# EAGLE design T4p1_cutout (EAGLE 9.6.2)
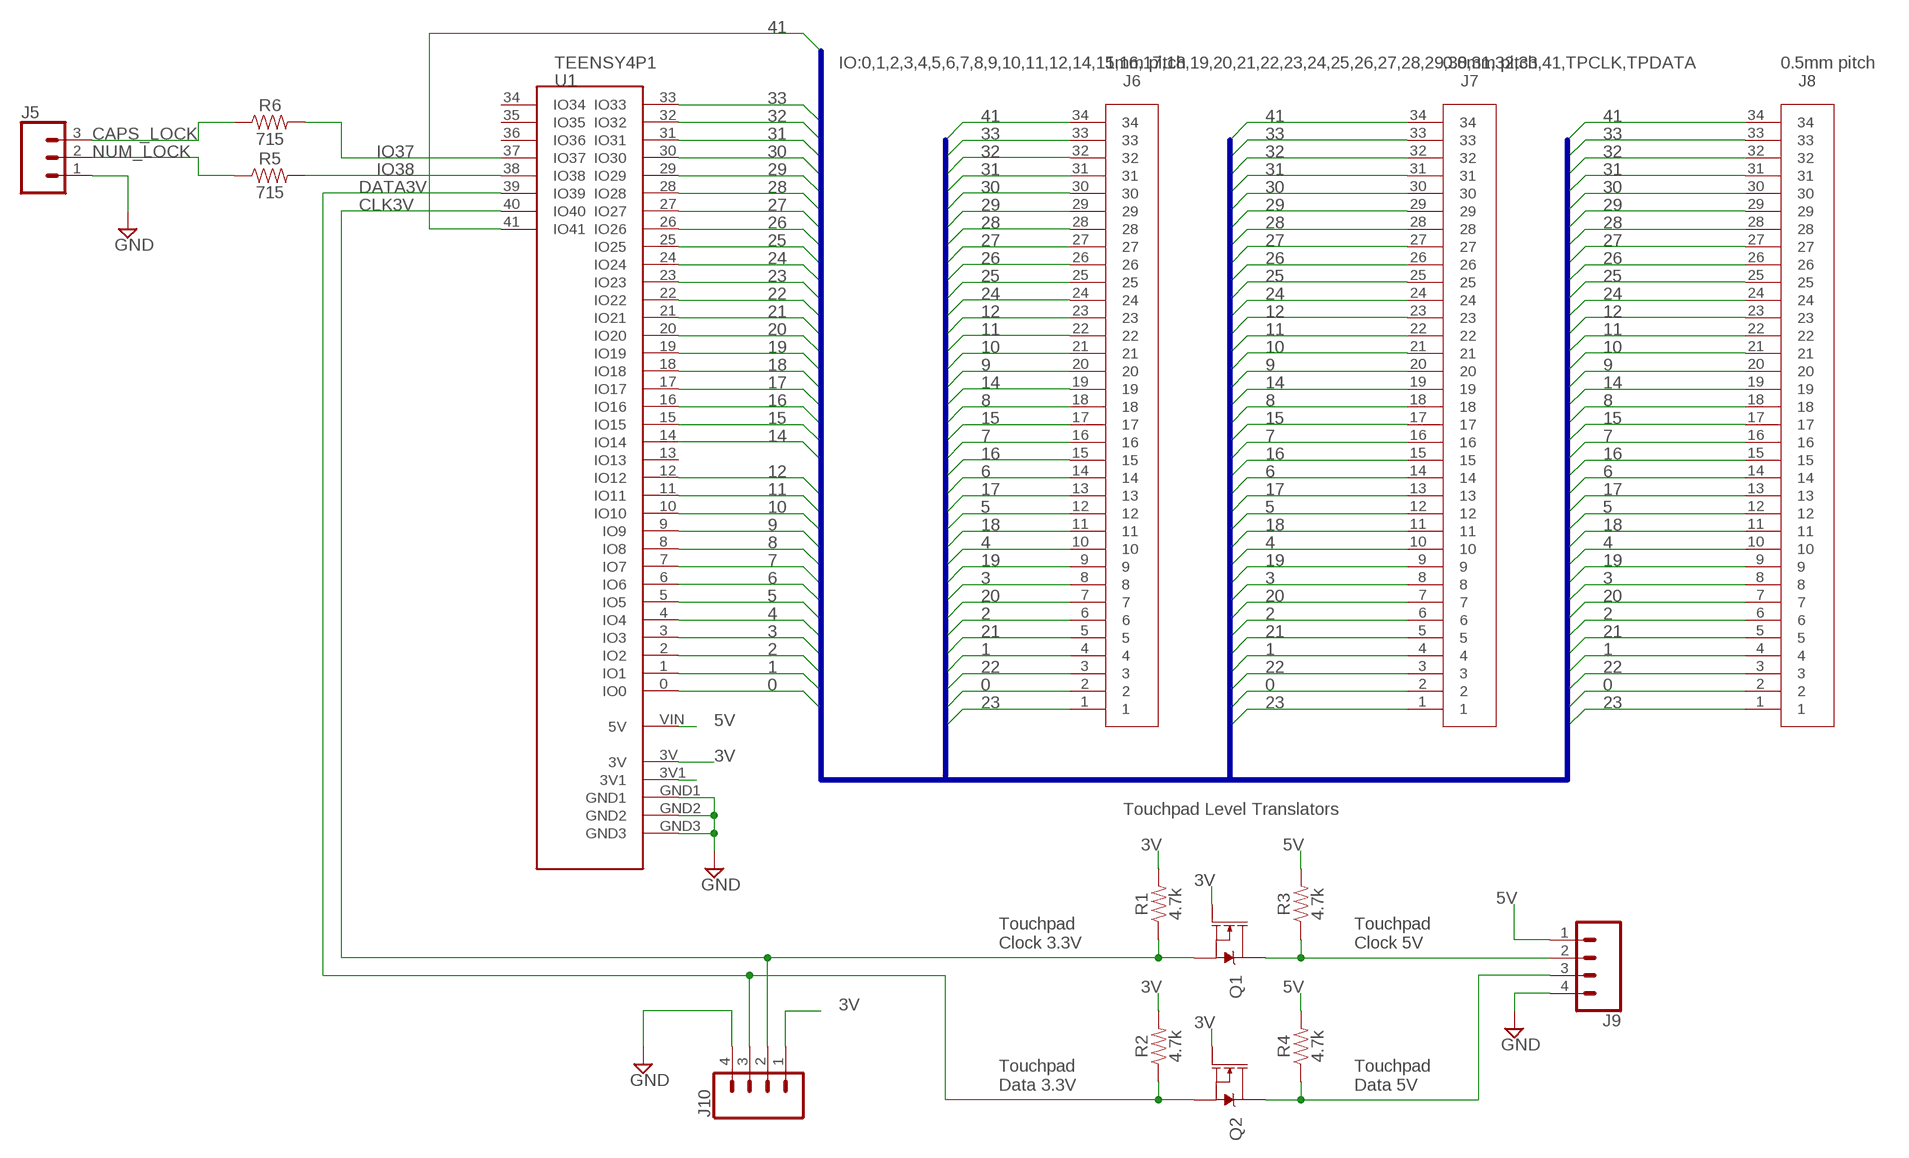
[diagram p0: schematic, sheet 1]

## Parts
J5  CONN_031X03_NO_SILK  [1X03_NO_SILK]
J6  FPC34  [FPC34]
J7  FPC34_P8MM  [FPC34_P8MM]
J8  FPC34_P5MM  [FPC34_P5MM]
J9  CONN_041X04_NO_SILK  [1X04_NO_SILK]
J10  CONN_041X04_NO_SILK  [1X04_NO_SILK]
Q1  220mA/50V/3.5Ω  MOSFET-NCH-BSS138  [SOT23-3]
Q2  220mA/50V/3.5Ω  MOSFET-NCH-BSS138  [SOT23-3]
R1  4.7k  4.7KOHM-0603-1/10W-1%  [0603]
R2  4.7k  4.7KOHM-0603-1/10W-1%  [0603]
R3  4.7k  4.7KOHM-0603-1/10W-1%  [0603]
R4  4.7k  4.7KOHM-0603-1/10W-1%  [0603]
R5  715  715OHM-0603-1/10W-1%  [0603]
R6  715  715OHM-0603-1/10W-1%  [0603]
U1  TEENSY4P1  TEENSY4P1_CUTOUT  [TEENSY4P0_CUTOUT]

## Nets
0: J6.2 J7.2 J8.2 U1.0(IO0)
1: J6.4 J7.4 J8.4 U1.1(IO1)
2: J6.6 J7.6 J8.6 U1.2(IO2)
3: J6.8 J7.8 J8.8 U1.3(IO3)
3V: J10.1 Q1.1(G) Q2.1(G) R1.2 R2.2 U1.3V
4: J6.10 J7.10 J8.10 U1.4(IO4)
5: J6.12 J7.12 J8.12 U1.5(IO5)
5V: J9.1 R3.2 R4.2 U1.VIN(5V)
6: J6.14 J7.14 J8.14 U1.6(IO6)
7: J6.16 J7.16 J8.16 U1.7(IO7)
8: J6.18 J7.18 J8.18 U1.8(IO8)
9: J6.20 J7.20 J8.20 U1.9(IO9)
10: J6.21 J7.21 J8.21 U1.10(IO10)
11: J6.22 J7.22 J8.22 U1.11(IO11)
12: J6.23 J7.23 J8.23 U1.12(IO12)
14: J6.19 J7.19 J8.19 U1.14(IO14)
15: J6.17 J7.17 J8.17 U1.15(IO15)
16: J6.15 J7.15 J8.15 U1.16(IO16)
17: J6.13 J7.13 J8.13 U1.17(IO17)
18: J6.11 J7.11 J8.11 U1.18(IO18)
19: J6.9 J7.9 J8.9 U1.19(IO19)
20: J6.7 J7.7 J8.7 U1.20(IO20)
21: J6.5 J7.5 J8.5 U1.21(IO21)
22: J6.3 J7.3 J8.3 U1.22(IO22)
23: J6.1 J7.1 J8.1 U1.23(IO23)
24: J6.24 J7.24 J8.24 U1.24(IO24)
25: J6.25 J7.25 J8.25 U1.25(IO25)
26: J6.26 J7.26 J8.26 U1.26(IO26)
27: J6.27 J7.27 J8.27 U1.27(IO27)
28: J6.28 J7.28 J8.28 U1.28(IO28)
29: J6.29 J7.29 J8.29 U1.29(IO29)
30: J6.30 J7.30 J8.30 U1.30(IO30)
31: J6.31 J7.31 J8.31 U1.31(IO31)
32: J6.32 J7.32 J8.32 U1.32(IO32)
33: J6.33 J7.33 J8.33 U1.33(IO33)
41: J6.34 J7.34 J8.34 U1.41(IO41)
CAPS_LOCK: J5.3 R6.1
CLK3V: J10.2 Q1.2(S) R1.1 U1.40(IO40)
CLK5V: J9.2 Q1.3(D) R3.1
DATA3V: J10.3 Q2.2(S) R2.1 U1.39(IO39)
DATA5V: J9.3 Q2.3(D) R4.1
GND: J5.1 J9.4 J10.4 U1.GND1 U1.GND2 U1.GND3
IO37: R6.2 U1.37(IO37)
IO38: R5.2 U1.38(IO38)
N$1: U1.3V1
NUM_LOCK: J5.2 R5.1
Unconnected: U1.13(IO13) U1.34(IO34) U1.35(IO35) U1.36(IO36)

## Buses
IO:0,1,2,3,4,5,6,7,8,9,10,11,12,14,15,16,17,18,19,20,21,22,23,24,25,26,27,28,29,30,31,32,33,41,TPCLK,TPDATA

## Notes on the sheet
- 1mm pitch | 0.8mm pitch | 0.5mm pitch
- Touchpad Level Translators
- Touchpad
  Clock 3.3V
- Touchpad
  Clock 5V
- Touchpad
  Data 3.3V
- Touchpad
  Data 5V

## Library data of the parts
J5 = SparkFun-Connectors:CONN_03: Multi connection point. Often used as Generic Header-pin footprint for 0.1 inch spaced/style header connections On any of the 0.1 inch spaced packages, you can populate with these: Break Away Headers - Straight <https://www.sparkfun.com/products/116> (PRT-00116) Break Away Male Headers - Right Angle <https://www.sparkfun.com/products/553> (PRT-00553) Female Headers <https://www.sparkfun.com/products/115> (PRT-00115) Break Away Headers - Machine Pin <https://www.sparkfun.com/products/117> (PRT-00117) Break Away Female Headers - Swiss Machine Pin <https://www.sparkfun.com/products/743> (PRT-00743) Stackable Header - 3 Pin (Female, 0.1") <https://www.sparkfun.com/products/13875> (PRT-13875) For SCREWTERMINALS and SPRING TERMINALS visit here: Screw Terimnals on SparkFun.com <https://www.sparkfun.com/search/results?term=Screw+Terminals> (5mm/3.5mm/2.54mm spacing) This device is also useful as a general connection point to wire up your design to another part of your project. Our various solder wires solder well into these plated through hole pads. Hook-Up Wire - Assortment (Stranded, 22 AWG) <https://www.sparkfun.com/products/11375> (PRT-11375) Hook-Up Wire - Assortment (Solid Core, 22 AWG) <https://www.sparkfun.com/products/11367> (PRT-11367) View the entire wire category on our website here <https://www.sparkfun.com/categories/141> Special notes: Molex polarized connector foot print use with SKU : PRT-08232 with associated crimp pins and housings.
J6 = FPC34:FPC34: Molex Right Angle FPC Connector 1mm pitch, bottom contacts with 32 pins. Molex Part Number DigiKey Part Number
J7 = FPC34_p8mm:FPC34_P8MM: Molex Right Angle FPC Connector 1mm pitch, bottom contacts with 32 pins. Molex Part Number DigiKey Part Number
J8 = FPC34_p5mm:FPC34_P5MM: Molex Right Angle FPC Connector 1mm pitch, bottom contacts with 32 pins. Molex Part Number DigiKey Part Number
J9 J10 = SparkFun-Connectors:CONN_04: Multi connection point. Often used as Generic Header-pin footprint for 0.1 inch spaced/style header connections On any of the 0.1 inch spaced packages, you can populate with these: Break Away Headers - Straight <https://www.sparkfun.com/products/116> (PRT-00116) Break Away Male Headers - Right Angle <https://www.sparkfun.com/products/553> (PRT-00553) Female Headers <https://www.sparkfun.com/products/115> (PRT-00115) Break Away Headers - Machine Pin <https://www.sparkfun.com/products/117> (PRT-00117) Break Away Female Headers - Swiss Machine Pin <https://www.sparkfun.com/products/743> (PRT-00743) For SCREWTERMINALS and SPRING TERMINALS visit here: Screw Terimnals on SparkFun.com <https://www.sparkfun.com/search/results?term=Screw+Terminals> (5mm/3.5mm/2.54mm spacing) This device is also useful as a general connection point to wire up your design to another part of your project. Our various solder wires solder well into these plated through hole pads. Hook-Up Wire - Assortment (Stranded, 22 AWG) <https://www.sparkfun.com/products/11375> (PRT-11375) Hook-Up Wire - Assortment (Solid Core, 22 AWG) <https://www.sparkfun.com/products/11367> (PRT-11367) View the entire wire category on our website here <https://www.sparkfun.com/categories/141> Special notes: Molex polarized connector foot print use with SKU : PRT-08231 with associated crimp pins and housings. 1MM SMD Version SKU: PRT-10208; PROD_ID: CONN-09696
Q1 Q2 = SparkFun-DiscreteSemi:MOSFET-NCH: N-channel MOSFETs Voltage controlled devices that allow control of high current outputs. SparkFun Products: SparkFun OpenScale <https://www.sparkfun.com/products/13261> SparkFun Digital Sandbox <https://www.sparkfun.com/products/12651> SparkFun Monster Moto Shield <https://www.sparkfun.com/products/10182> SparkFun MOSFET Power Controller <https://www.sparkfun.com/products/11214>; PROD_ID: TRANS-00830
R1-R4 = SparkFun-Resistors:4.7KOHM: 4.7kΩ resistor A resistor is a passive two-terminal electrical component that implements electrical resistance as a circuit element. Resistors act to reduce current flow, and, at the same time, act to lower voltage levels within circuits. - Wikipedia; PROD_ID: RES-07857
R5 R6 = SparkFun-Resistors:715OHM: 715Ω resistor A resistor is a passive two-terminal electrical component that implements electrical resistance as a circuit element. Resistors act to reduce current flow, and, at the same time, act to lower voltage levels within circuits. - Wikipedia; PROD_ID: RES-07850
U1 = TEENSY4P1_CUTOUT:TEENSY4P1_CUTOUT

## Board
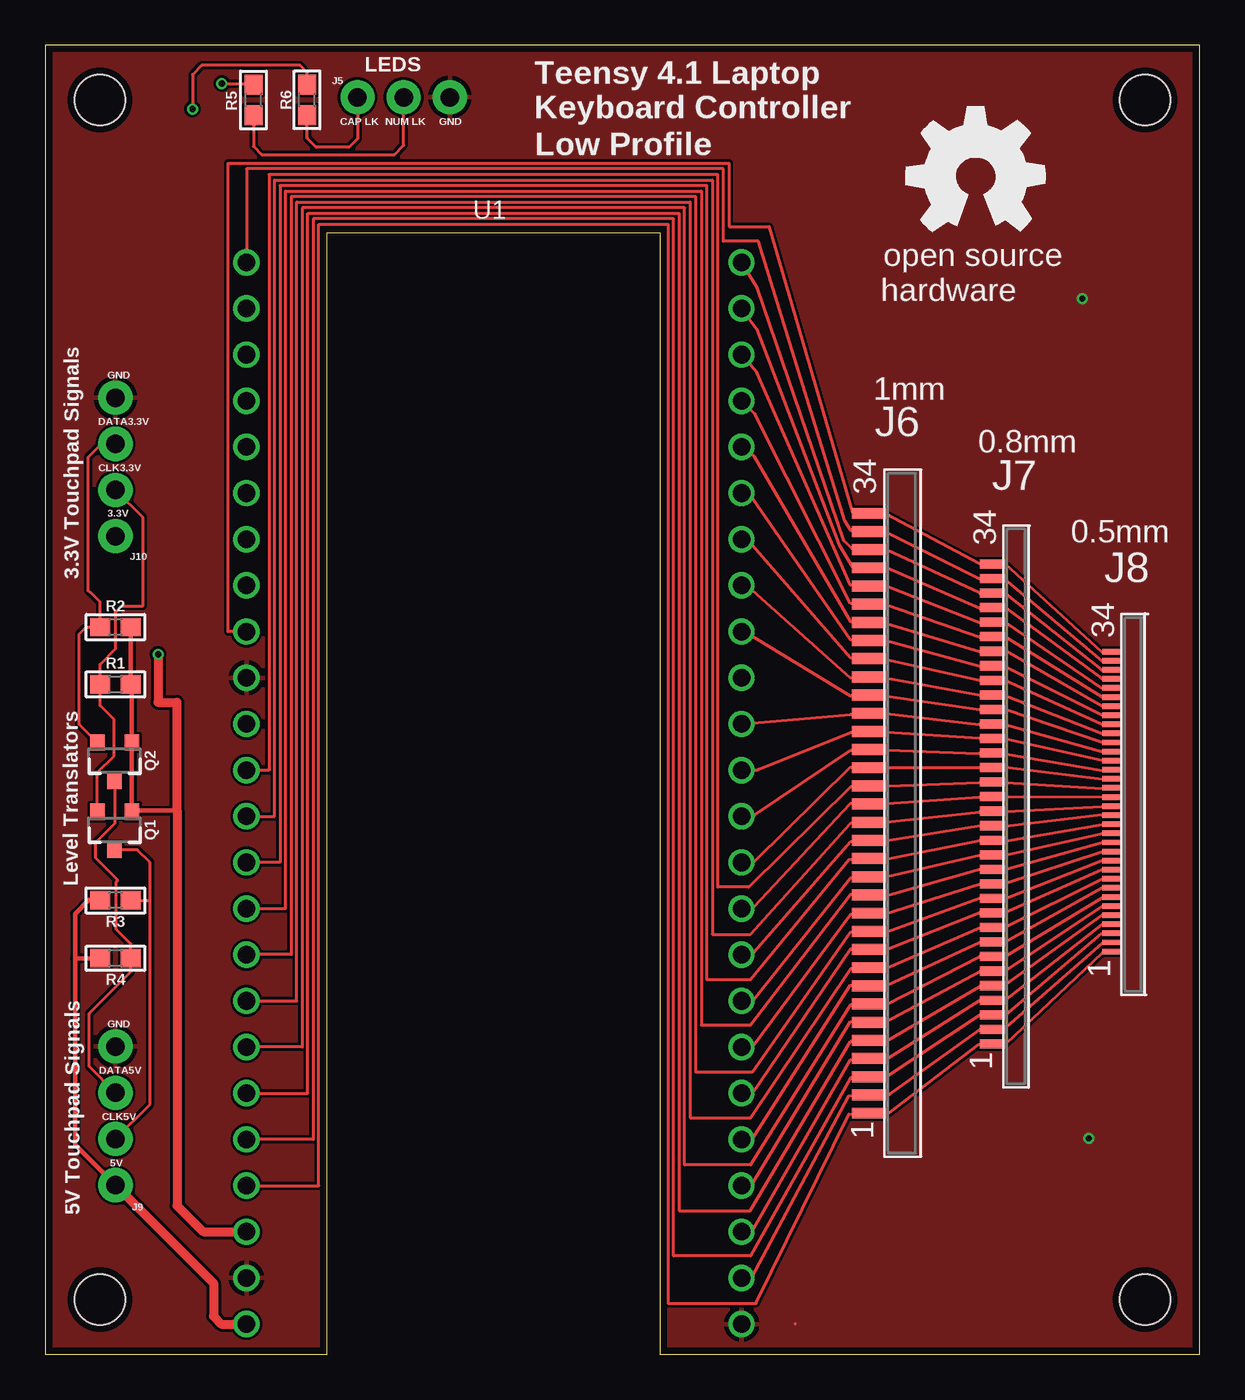
[diagram p1: board, top side]
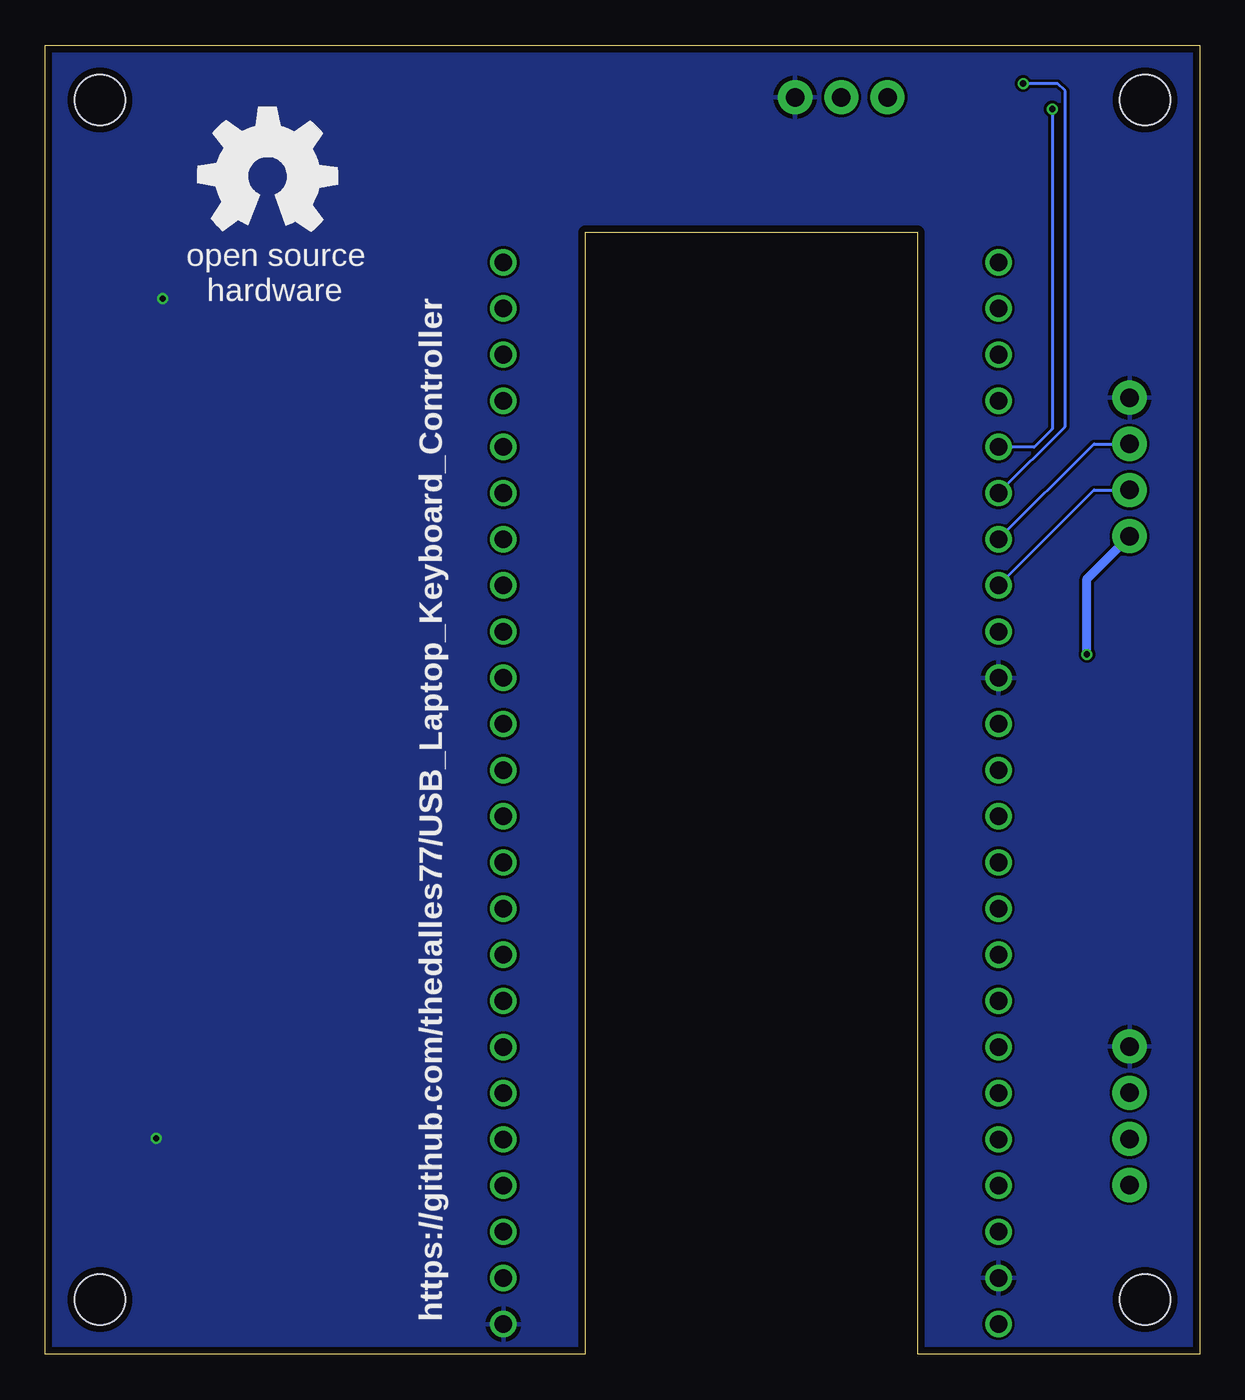
[diagram p2: board, bottom side, seen from below]

Size 63.5 x 72 mm. Coordinates in mm from the lower left corner, seen from the top.
Outline: 0,0 15.5,0 15.5,61.7 33.8,61.7 33.8,0 63.5,0 63.5,72 0,72 0,0
Copper layers (1*16): Top 0.035559375mm / dielectric 1.6mm / Bottom 0.035559375mm
Design rules "oshpark-2layer": minimum track width 6mil, minimum drill 10mil, track to track 6mil, track to pad 6mil, pad to pad 6mil, via to via 6mil, smd to smd 6mil, copper to edge 15mil, drill to drill 6mil, minimum pad ring 5mil, minimum via ring 5mil, stop-mask expansion 2.5mil, vias tented up to drill 0mil, thermal gap 10mil
Holes 2.8 mm at 3,3 60.5,3 60.5,69 3,69

### Footprints (pad centres in the part's own frame; a part is rotated, then mirrored left to right if it is on the bottom)
1X03_NO_SILK = drill 1.016 pad 1.88: 1 0,0; 2 2.54,0; 3 5.08,0
FPC34 = smd 0.6 x 1.9: 1 -13.7,3.86; 2 -12.7,3.86; 3 -11.7,3.86; 4 -10.7,3.86; 5 -9.7,3.86; 6 -8.7,3.86; 7 -7.7,3.86; 8 -6.7,3.86; 9 -5.7,3.86; 10 -4.7,3.86; 11 -3.7,3.86; 12 -2.7,3.86; 13 -1.7,3.86; 14 -0.7,3.86; 15 0.3,3.86; 16 1.3,3.86; 17 2.3,3.86; 18 3.3,3.86; 19 4.3,3.86; 20 5.3,3.86; 21 6.3,3.86; 22 7.3,3.86; 23 8.3,3.86; 24 9.3,3.86; 25 10.3,3.86; 26 11.3,3.86; 27 12.3,3.86; 28 13.3,3.86; 29 14.3,3.86; 30 15.3,3.86; 31 16.3,3.86; 32 17.3,3.86; 33 18.3,3.86; 34 19.3,3.86
FPC34_P8MM = smd 0.5 x 1.35: 1 -13.7,3.6; 2 -12.9,3.6; 3 -12.1,3.6; 4 -11.3,3.6; 5 -10.5,3.6; 6 -9.7,3.6; 7 -8.9,3.6; 8 -8.1,3.6; 9 -7.3,3.6; 10 -6.5,3.6; 11 -5.7,3.6; 12 -4.9,3.6; 13 -4.1,3.6; 14 -3.3,3.6; 15 -2.5,3.6; 16 -1.7,3.6; 17 -0.9,3.6; 18 -0.1,3.6; 19 0.7,3.6; 20 1.5,3.6; 21 2.3,3.6; 22 3.1,3.6; 23 3.9,3.6; 24 4.7,3.6; 25 5.5,3.6; 26 6.3,3.6; 27 7.1,3.6; 28 7.9,3.6; 29 8.7,3.6; 30 9.5,3.6; 31 10.3,3.6; 32 11.1,3.6; 33 11.9,3.6; 34 12.7,3.6
FPC34_P5MM = smd 0.3 x 1.1: 1 -13.7,3.5; 2 -13.2,3.5; 3 -12.7,3.5; 4 -12.2,3.5; 5 -11.7,3.5; 6 -11.2,3.5; 7 -10.7,3.5; 8 -10.2,3.5; 9 -9.7,3.5; 10 -9.2,3.5; 11 -8.7,3.5; 12 -8.2,3.5; 13 -7.7,3.5; 14 -7.2,3.5; 15 -6.7,3.5; 16 -6.2,3.5; 17 -5.7,3.5; 18 -5.2,3.5; 19 -4.7,3.5; 20 -4.2,3.5; 21 -3.7,3.5; 22 -3.2,3.5; 23 -2.7,3.5; 24 -2.2,3.5; 25 -1.7,3.5; 26 -1.2,3.5; 27 -0.7,3.5; 28 -0.2,3.5; 29 0.3,3.5; 30 0.8,3.5; 31 1.3,3.5; 32 1.8,3.5; 33 2.3,3.5; 34 2.8,3.5
1X04_NO_SILK = drill 1.016 pad 1.88: 1 0,0; 2 2.54,0; 3 5.08,0; 4 7.62,0
SOT23-3 = smd 0.8 x 0.9: 1 -0.95,-1; 2 0.95,-1; 3 0,1.1
0603 = smd 1.1 x 1: 1 -0.85,0; 2 0.85,0
TEENSY4P0_CUTOUT = drill 0.965: 0 -15.24,-13.62; 1 -12.7,-13.62; 2 -10.16,-13.62; 3 -7.62,-13.62; 3V -12.7,13.62; 3V1 17.78,-13.62; 4 -5.08,-13.62; 5 -2.54,-13.62; 6 0,-13.62; 7 2.54,-13.62; 8 5.08,-13.62; 9 7.62,-13.62; 10 10.16,-13.62; 11 12.7,-13.62; 12 15.24,-13.62; 13 15.24,13.62; 14 12.7,13.62; 15 10.16,13.62; 16 7.62,13.62; 17 5.08,13.62; 18 2.54,13.62; 19 0,13.62; 20 -2.54,13.62; 21 -5.08,13.62; 22 -7.62,13.62; 23 -10.16,13.62; 24 20.32,-13.62; 25 22.86,-13.62; 26 25.4,-13.62; 27 27.94,-13.62; 28 30.48,-13.62; 29 33.02,-13.62; 30 35.56,-13.62; 31 38.1,-13.62; 32 40.64,-13.62; 33 40.64,13.62; 34 38.1,13.62; 35 35.56,13.62; 36 33.02,13.62; 37 30.48,13.62; 38 27.94,13.62; 39 25.4,13.62; 40 22.86,13.62; 41 20.32,13.62; GND1 -17.78,-13.62; GND2 -15.24,13.62; GND3 17.78,13.62; VIN -17.78,13.62

### Placement (x,y rotation side)
J5  22.25,69.15 180 top
J6  49.17,26.96 90 top
J7  55.7,30.77 90 top
J8  62.2,35.85 90 top
J9  3.85,9.3 90 top
J10  3.85,45 90 top
Q1  3.8,28.84 180 top
Q2  3.8,32.65 180 top
R1  3.85,36.85 0 top
R2  3.85,40 0 top
R3  3.85,24.97 180 top
R4  3.85,21.78 180 top
R5  11.45,69 90 top
R6  14.4,69 90 top
U1  24.68,19.43 90 top
U$1  [OSHW_8MM]  51.16,64.79 0 top
U$2  [OSHW_8MM]  51.25,64.79 0 top

### Tracks (layer width: path | path; a pad name or v marks a point on that pad's centre or on a via)
0
  Top 0.152: J8.2 58.16,22.62 52.86,18.01 J7.2 51.45,17.86 46.41,14.25 J6.2 44.2,14.2 38.84,4.18 38.83,4.19 U1.0
1
  Top 0.152: J8.4 58.12,23.63 52.81,19.48 J7.4 51.41,19.46 46.32,16.23 J6.4 44.3,16.2 38.87,6.72 38.86,6.73 U1.1
2
  Top 0.152: J8.6 58.13,24.63 52.79,21.08 J7.6 51.4,21.03 46.21,18.25 J6.6 44.3,18.3 38.8,9.2 38.73,9.27 U1.2
3
  Top 0.152: J8.8 58.15,25.65 52.79,22.64 J7.8 51.43,22.65 46.28,20.26 J6.8 44.3,20.3 38.84,11.77 38.81,11.81 U1.3
3V  (via drill 0.35)
  Top 0.254: R2.2 R1.2 4.75,36.8 Q2.1 Q1.1 4.75,29.9 7.24,29.9
  Top 0.508: v6.2,38.5 6.2,35.85 7.24,35.85 7.24,29.9 7.24,8.17 8.68,6.73 U1.3V
  Bottom 0.508: v6.2,38.5 6.2,42.65 J10.1
4
  Top 0.152: J8.10 58.13,26.63 52.79,24.26 J7.10 51.41,24.26 46.26,22.25 J6.10 44.3,22.3 38.88,14.31 38.84,14.35 U1.4
5
  Top 0.152: J8.12 58.15,27.62 52.79,25.88 J7.12 51.4,25.84 46.28,24.22 J6.12 44.3,24.2 38.86,16.88 38.86,16.89 U1.5
5V
  Top 0.254: R3.2 2.4,24.97 2.39,24.98 1.64,24.23 1.64,21.78 | 1.64,21.78 1.64,11.52 J9.1 | R4.2 1.64,21.78
  Top 0.508: J9.1 9.25,3.9 9.25,2.08 9.68,1.65 U1.VIN
6
  Top 0.152: J8.14 58.12,28.63 52.81,27.44 J7.14 51.4,27.43 46.3,26.25 J6.14 44.3,26.2 38.85,19.36 38.78,19.43 U1.6
7
  Top 0.152: 45.23,28.25 44.3,28.2 38.79,21.91 38.73,21.97 U1.7 | 45.23,28.25 J6.16 | 45.23,28.25 46.3,28.24 51.43,29.07 J7.16 52.83,29.04 58.12,29.65 J8.16
8
  Top 0.152: J8.18 58.14,30.65 52.81,30.63 J7.18 51.38,30.63 46.3,30.26 J6.18 44.3,30.3 38.99,24.61 38.9,24.51 U1.8
9
  Top 0.152: J8.20 58.16,31.62 52.78,32.27 J7.20 51.41,32.25 46.25,32.25 J6.20 44.3,32.3 39,27.1 38.95,27.05 U1.9
10
  Top 0.152: J8.21 58.16,32.11 52.83,33.02 J7.21 51.38,33.05 46.28,33.23 J6.21 44.3,33.2 38.98,29.62 38.95,29.59 U1.10
11
  Top 0.152: J8.22 58.12,32.67 52.79,33.84 J7.22 51.41,33.86 46.26,34.19 J6.22 44.3,34.2 39.21,32.17 39.18,32.13 U1.11
12
  Top 0.152: J8.23 58.12,33.16 52.81,34.63 J7.23 51.38,34.64 46.26,35.24 J6.23 44.29,35.2 U1.12
14
  Top 0.152: J8.19 58.19,31.13 52.81,31.45 J7.19 51.4,31.45 46.3,31.27 J6.19 44.3,31.2 38.7,25.7 37,25.7 37,64.9 12.3,64.9 12.3,32.12 U1.14
15
  Top 0.152: J8.17 58.14,30.14 52.83,29.86 J7.17 51.4,29.84 46.28,29.28 J6.17 44.3,29.2 38.8,23.1 36.7,23.1 36.7,64.6 12.6,64.6 12.6,29.59 U1.15
16
  Top 0.152: J8.15 58.16,29.14 52.84,28.24 J7.15 51.4,28.27 46.3,27.24 J6.15 44.2,27.2 38.8,20.6 36.39,20.6 36.39,64.29 12.91,64.29 12.91,27.05 U1.16
17
  Top 0.152: J8.13 58.13,28.15 52.78,26.67 J7.13 51.45,26.7 46.3,25.23 J6.13 44.3,25.3 38.8,18.1 36.09,18.1 36.09,63.99 13.21,63.99 13.21,24.51 U1.17
18
  Top 0.152: J8.11 58.13,27.15 52.81,25.08 J7.11 51.41,25.09 46.26,23.23 J6.11 44.3,23.2 38.9,15.5 35.78,15.5 35.78,63.68 13.52,63.68 13.52,21.98 U1.18
19
  Top 0.152: J8.9 58.13,26.13 52.75,23.48 J7.9 51.43,23.47 46.3,21.24 J6.9 44.3,21.2 38.8,13 35.48,13 35.48,63.38 13.82,63.38 13.82,19.43 U1.19
20
  Top 0.152: J8.7 58.13,25.11 52.77,21.86 J7.7 51.41,21.88 46.26,19.23 J6.7 44.3,19.2 38.8,10.4 35.17,10.4 35.17,63.07 14.13,63.07 14.13,16.89 U1.20
21
  Top 0.152: J8.5 58.12,24.14 52.82,20.3 J7.5 51.4,20.24 46.3,17.24 J6.5 44.3,17.2 38.8,7.9 38.8,7.89 34.87,7.89 34.87,62.77 14.43,62.77 14.43,14.35 U1.21
22
  Top 0.152: J8.3 58.13,23.14 52.81,18.63 J7.3 51.4,18.65 46.3,15.28 J6.3 44.3,15.2 38.8,5.4 34.56,5.4 34.56,62.46 14.74,62.46 14.74,11.81 U1.22
23
  Top 0.152: J8.1 58.17,22.1 52.84,17.07 J7.1 51.37,17.03 46.32,13.2 J6.1 44.2,13.2 39.1,2.8 39.1,2.79 34.26,2.79 34.26,62.16 15.04,62.16 15.04,9.27 U1.23
24
  Top 0.152: U1.24 38.4,39.78 44.3,36.2 J6.24 46.28,36.18 51.41,35.45 J7.24 52.78,35.46 58.12,33.65 J8.24
25
  Top 0.152: U1.25 38.6,42.28 44.3,37.2 J6.25 46.28,37.21 51.4,36.25 J7.25 52.81,36.23 58.14,34.14 J8.25
26
  Top 0.152: U1.26 38.71,44.7 44.3,38.3 J6.26 46.3,38.19 51.38,37.07 J7.26 52.79,37.05 58.12,34.64 J8.26
27
  Top 0.152: U1.27 38.9,47.06 44.3,39.3 J6.27 46.28,39.25 51.41,37.85 J7.27 52.81,37.82 58.14,35.15 J8.27
28
  Top 0.152: U1.28 38.97,49.4 44.3,40.3 J6.28 | J6.28 | J7.28 52.04,38.67 | 52.04,38.67 51.41,38.64 46.3,40.18 J6.28 | J8.28 58.14,35.64 52.83,38.69 52.04,38.67
29
  Top 0.152: U1.29 39.04,51.73 44.3,41.3 J6.29 46.32,41.21 51.41,39.46 J7.29 52.83,39.46 58.14,36.14 J8.29
30
  Top 0.152: U1.30 39.15,54 44.3,42.3 J6.30 46.3,42.22 51.41,40.23 J7.30 52.83,40.25 58.16,36.63 J8.30
31
  Top 0.152: U1.31 39.12,56.41 43.66,44.53 44.4,43.3 J6.31 46.3,43.27 51.41,41.05 J7.31 52.83,41.05 58.12,37.16 J8.31
32
  Top 0.152: U1.32 39.17,58.64 43.93,44.75 44.36,44.33 J6.32 46.3,44.23 51.41,41.87 J7.32 52.83,41.83 58.12,37.63 J8.32
33
  Top 0.152: J8.33 58.14,38.13 52.79,42.64 J7.33 51.38,42.66 46.32,45.2 J6.33 44.32,45.3 43.98,45.82 39.23,61.23 37.3,61.23 37.3,65.2 11.06,65.2 U1.33
41
  Top 0.152: J8.34 58.12,38.64 52.79,43.49 J7.34 51.41,43.48 46.25,46.22 J6.34 44.41,46.3 39.82,62.03 37.61,62.03 37.61,65.51 10.04,65.51 10.04,39.75 U1.41
CAPS_LOCK
  Top 0.152: J5.3 17.17,66.87 16.7,66.4 14.9,66.4 14.4,66.9 R6.1
CLK3V
  Top 0.152: Q1.2 2.85,32 3.77,32.92 3.77,34.91 3,35.68 R1.1 3,37.95 3.86,38.81 3.86,40.83 4.18,41.15 5.35,41.15 5.35,46.04 J10.2
  Bottom 0.152: U1.40 5.81,47.54 J10.2
CLK5V
  Top 0.152: J9.2 5.76,13.75 5.76,24.95 | 5.76,24.95 5.76,27.04 5.06,27.74 Q1.3 | R3.1 5.74,24.97 5.76,24.95
DATA3V
  Top 0.152: Q2.2 1.86,34.64 1.86,39.63 2.23,40 R2.1 3,41.39 2.49,41.9 2.45,41.9 2.35,42 2.35,49.35 3.08,50.08 J10.3
  Bottom 0.152: U1.39 5.81,50.08 J10.3
DATA5V
  Top 0.152: J9.3 2.41,15.82 2.41,18.74 4.7,21.03 4.7,21.68 4.65,21.73 | R4.1 4.7,22.57 3.9,23.37 3.9,25.98 3.95,26.03 3.95,26.11 2.77,27.29 2.77,28.16 3.8,29.19 Q2.3
  Top 0.254: 4.65,21.73 R4.1
GND  (via drill 0.35)
  Top 0.152: 41.26,1.65 41.26,1.67
  other vias: 57.41,11.87 57.05,58.07
  pour Top: 0,0 0,72 63.5,72 63.5,0 33.8,0 33.8,61.7 15.5,61.7 15.5,0
  pour Bottom: 0,0 0,72 63.48,72 63.48,0 33.8,0 33.8,61.7 15.5,61.7 15.5,0
IO37  (via drill 0.35)
  Top 0.152: R6.2 14.4,70.5 14,70.9 8.6,70.9 8.1,70.4 v8.1,68.5
  Bottom 0.152: v8.1,68.5 8.1,50.9 9.1,49.9 U1.37
IO38  (via drill 0.35)
  Top 0.152: v9.7,69.9 11.4,69.9 R5.2
  Bottom 0.152: U1.38 7.39,51.03 7.39,69.5 7.8,69.9 v9.7,69.9
NUM_LOCK
  Top 0.152: R5.1 11.45,66.45 11.9,66 19.2,66 19.71,66.51 J5.2

### Text on the board
tPlace: LEDS | CAP LK | NUM LK | GND | Teensy 4.1 Laptop / Keyboard Controller | Low Profile | U1 | GND | 1mm | DATA3.3V | 0.8mm | CLK3.3V | 34 | 3.3V | 0.5mm | 34 | 3.3V Touchpad Signals | 34 | Level Translators | GND | DATA5V | CLK5V | 5V | 5V Touchpad Signals
bPlace: https://github.com/thedalles77/USB_Laptop_Keyboard_Controller